# EAGLE design sensor_breakout (EAGLE 6.5.0)
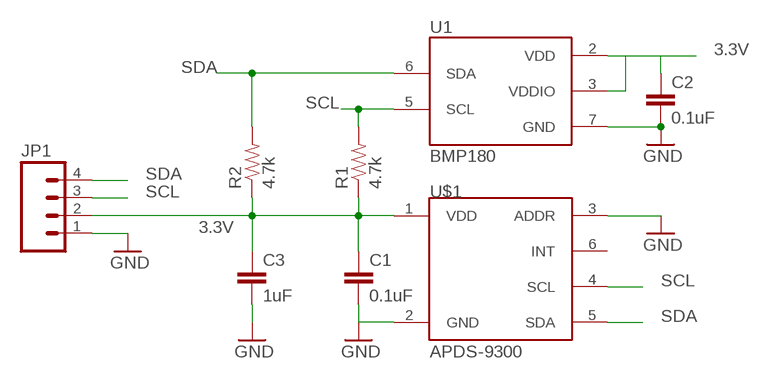
[diagram p0: schematic, sheet 1]

## Parts
C1  0.1uF  CAP0402-S  [0402-S]
C2  0.1uF  CAP0402-S  [0402-S]
C3  1uF  CAP0402-S  [0402-S]
JP1  M04LOCK  [1X04_LOCK]
R1  4.7k  RESISTOR0402-S  [0402-S]
R2  4.7k  RESISTOR0402-S  [0402-S]
U1  BMP180  [BMP180]
U$1  APDS-9300  [CHIPLED]

## Nets
3.3V: C1.1 C2.1 C3.1 JP1.2 R1.1 R2.1 U1.2(VDD) U1.3(VDDIO) U$1.1(VDD)
GND: C1.2 C2.2 C3.2 JP1.1 U1.7(GND) U$1.2(GND) U$1.3(ADDR)
SCL: JP1.3 R1.2 U1.5(SCL) U$1.4(SCL)
SDA: JP1.4 R2.2 U1.6(SDA) U$1.5(SDA)
Unconnected: U$1.6(INT)

## Library data of the parts
C1-C3 = chips:CAP: Capacitor Standard 0603 ceramic capacitor, and 0.1" leaded capacitor.
JP1 = SparkFun-Connectors:M04: Header 4 Standard 4-pin 0.1" header. Use with straight break away headers (SKU : PRT-00116), right angle break away headers (PRT-00553), swiss pins (PRT-00743), machine pins (PRT-00117), and female headers (PRT-00115). Molex polarized connector foot print use with SKU : PRT-08231 with associated crimp pins and housings. 1MM SMD Version SKU: PRT-10208
R1 R2 = chips:RESISTOR: Resistor Basic schematic elements and footprints for 0603, 1206, and PTH resistors.
U1 = SparkFun-Sensors:BMP180: BOSCH BMP180 DIGITAL BAROMETRIC PRESSURE SENSOR Web page: http://www.bosch-sensortec.com/en/homepage/products_3/environmental_sensors_1/bmp180_1/bmp180 Datasheet: http://ae-bst.resource.bosch.com/media/products/dokumente/bmp180/BST-BMP180-DS000-09.pdf The BMP180 is the function compatible successor of the BMP085, a new generation of high precision digital pressure sensors for consumer applications. The ultra-low power, low voltage electronics of the BMP180 is optimized for use in mobile phones, PDAs, GPS navigation devices and outdoor equipment. With a low altitude noise of merely 0.25m at fast conversion time, the BMP180 offers superior performance. The I2C interface allows for easy system integration with a microcontroller. The BMP180 is based on piezo-resistive technology for EMC robustness, high accuracy and linearity as well as long term stability. Key features: - Temperature measurement included - I2C interface - Fully calibrated - Pb-free, halogen-free and RoHS compliant, - MSL 1 Basic specs: Pressure range: 300 to 1100hPa (+9000m to -500m relating to sea level) Supply voltage: 1.8 to 3.6V (VDD), 1.62V to 3.6V (VDDIO) Package: LGA package with metal lid Small footprint: 3.6mm x 3.8mm Super-flat: 0.93mm height Low power: 5μA at 1 sample / sec. in standard mode Low noise: 0.06hPa (0.5m) in ultra low power mode, 0.02hPa (0.17m) advanced resolution mode Typical applications: - Enhancement of GPS navigation (dead-reckoning, slope detection, etc.) - In- and out-door navigation - Leisure and sports - Weather forecast - Vertical velocity indication (rise/sink speed)
U$1 = intelliDesk:APDS-9300

## Board
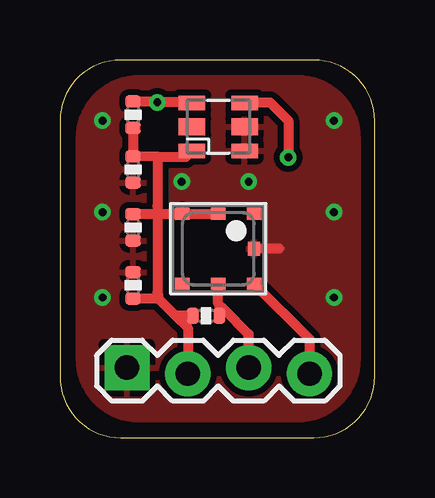
[diagram p1: board, top side]
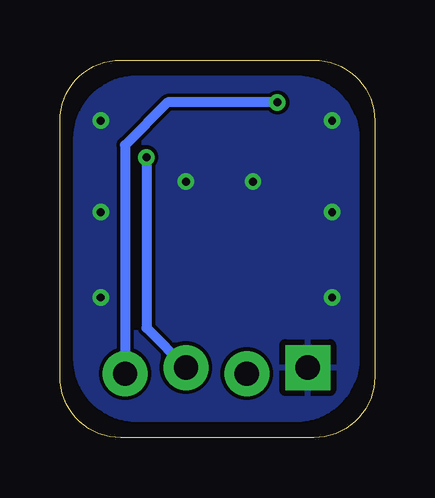
[diagram p2: board, bottom side, seen from below]

Size 13.13 x 15.74 mm. Coordinates in mm from the lower left corner, seen from the top.
Outline: 0,13.2 0,2.54 arc90 2.54,0 10.59,0 arc90 13.13,2.54 13.13,13.2 arc90 10.59,15.74 2.54,15.74 arc90 0,13.2
Copper layers (1*16): Top 0.0356mm / dielectric 1.5011mm / Bottom 0.0356mm
Design rules "LaenPCBOrder": minimum track width 6mil, minimum drill 13mil, track to track 6mil, track to pad 6mil, pad to pad 6mil, via to via 6mil, smd to smd 6mil, copper to edge 15mil, drill to drill 6mil, minimum pad ring 7mil, minimum via ring 7mil, stop-mask expansion 0mil, vias tented up to drill 13mil, thermal gap 10mil
tRestrict: 7 lines

### Footprints (pad centres in the part's own frame; a part is rotated, then mirrored left to right if it is on the bottom)
0402-S = smd 0.5 x 0.65: 1 -0.55,0; 2 0.55,0
1X04_LOCK = drill 1.016 pad 1.88 square: 1 0,0.127 | drill 1.016 pad 1.88: 2 2.54,-0.127; 3 5.08,0.127; 4 7.62,-0.127
BMP180 = smd 0.6 x 0.5: 1 1.5,1.45; 2 0,1.45; 3 -1.5,1.45; 4 -1.5,-1.45; 5 0,-1.45; 6 1.5,-1.45 | smd 0.5 x 0.6: 7 1.5,0
CHIPLED = smd 1.1 x 0.6: 1 -1.1,-1; 2 1.1,-1; 4 1.1,1; 5 -1.1,1 | smd 1.1 x 0.7: 3 1.1,0; 6 -1.1,0

### Placement (x,y rotation side)
C1  3.05,11.18 270 top
C2  3.05,8.76 270 top
C3  3.05,6.35 90 top
JP1  2.79,2.79 0 top
R1  6.1,5.08 0 top
R2  3.05,13.46 90 top
U1  6.6,7.87 0 top
U$1  6.6,12.95 0 top

### Tracks (layer width: path | path; a pad name or v marks a point on that pad's centre or on a via)
3.3V
  Top 0.254: 4.06,9.31 6.59,9.31 U1.2 | 4.11,11.7 4.11,9.69 4.06,9.65
  Top 0.406: C1.1 4.11,11.7 5.25,11.7 U$1.1 | 5.1,9.4 U1.3 | U1.3 U1.2 | 4.11,5.8 4.83,5.08 | 4.83,5.08 5.33,4.57 JP1.2 | R1.1 4.83,5.08 | C1.1 3.05,11.68 | 4.06,11.68 4.06,9.65 4.06,9.31 | 4.06,9.32 U1.3 | 4.06,9.31 C2.1 | 4.11,5.8 C3.1 | 4.06,9.31 4.06,6.05 4.11,5.8 | R2.1 C1.1
GND  (via drill 0.33)
  Top 0.406: U1.7 8.13,7.87 9.14,7.87
  other vias: 1.78,5.84 1.78,9.4 1.78,13.21 11.43,13.21 11.43,9.4 11.43,5.84 5.08,10.67 7.87,10.67
  pour Top (isolate 0.254): 0.76,12.45 0.76,3.3 arc90 3.3,0.76 9.91,0.76 arc90 12.45,3.3 12.45,12.45 arc90 9.91,14.99 3.3,14.99 arc90
  pour Bottom: 0.76,12.45 0.76,3.3 arc90 3.3,0.76 9.91,0.76 arc90 12.45,3.3 12.45,12.45 arc90 9.91,14.99 3.3,14.99 arc90
SCL  (via drill 0.33)
  Top 0.406: 6.86,5.33 7.87,4.32 JP1.3 7.87,4.19 | 6.86,5.33 6.6,5.59 U1.5 | R1.2 6.65,5.33 6.86,5.33 | U$1.4 7.72,13.97 8.76,13.97 9.52,13.21 v9.52,11.68
  Bottom 0.406: v9.52,11.68 9.52,4.57 JP1.3
SDA  (via drill 0.33)
  Top 0.406: U$1.5 5.5,13.97 v4.06,13.97 4.02,14.01 R2.2 | U1.6 10.41,4.11 JP1.4
  Bottom 0.406: v4.06,13.97 8.64,13.97 10.41,12.19 JP1.4